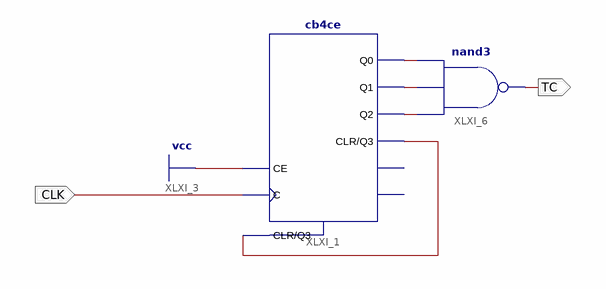
[diagram p0: schematic sheet 1]
// Xilinx ISE schematic Counter8_TC.sch (spartan6) as structural Verilog: 2 symbols, 2 ports
module Counter8_TC (
  input  CLK,
  output TC
);

  wire RESET, XLXN_6, XLXN_7, XLXN_8;

  cb4ce XLXI_1 (.C(CLK), .CE(1'b1), .CLR(RESET), .Q0(XLXN_8), .Q1(XLXN_7), .Q2(XLXN_6), .Q3(RESET));  // open: CEO, TC
  nand XLXI_6 (TC, XLXN_6, XLXN_7, XLXN_8);
endmodule
